# Altium schematic sheet psu.SchDoc
size A4
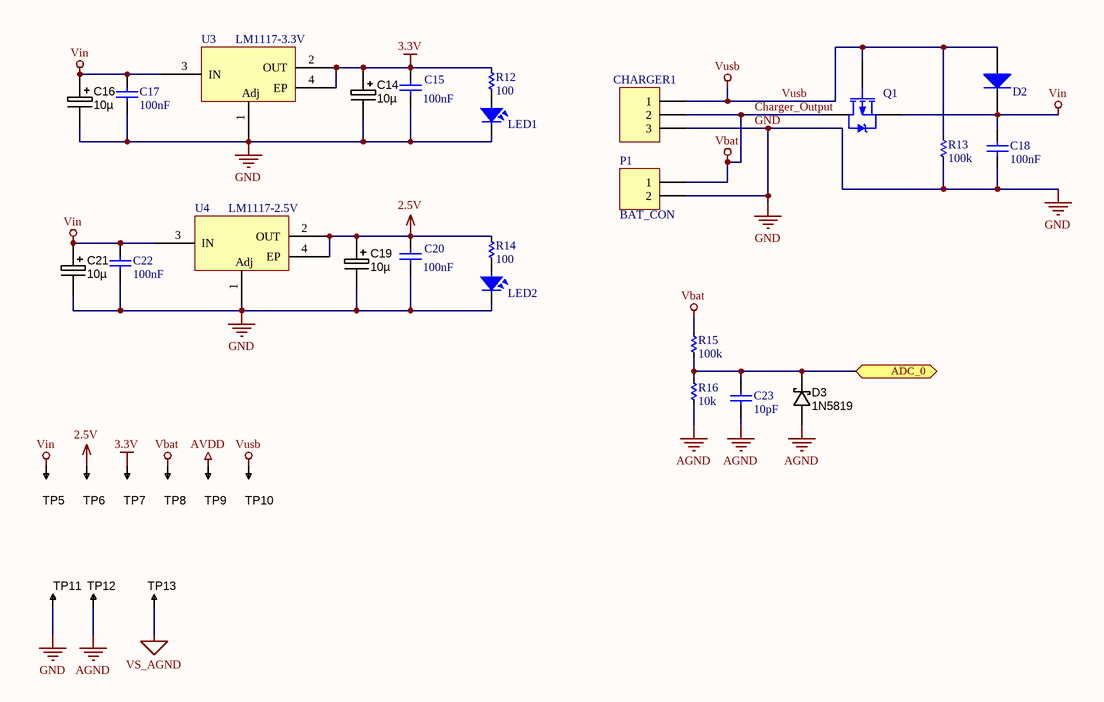
[diagram p0: psu.SchDoc]

## Parts
C14  10µ  [CAPMP3216X180N]
C15  value 100nF  [CAPC1608X90N]  (hidden comment: Cap Semi)
C16  10µ  [CAPMP3216X180N]
C17  value 100nF  [CAPC1608X90N]  (hidden comment: Cap Semi)
C18  value 100nF  [CAPC1608X90N]  (hidden comment: Cap Semi)
C19  10µ  [CAPMP3216X180N]
C20  value 100nF  [CAPC1608X90N]  (hidden comment: Cap Semi)
C21  10µ  [CAPMP3216X180N]
C22  value 100nF  [CAPC1608X90N]  (hidden comment: Cap Semi)
C23  value 10pF  [CAPC1608X90N]  (hidden comment: Cap Semi)
CHARGER1  3-Pin connector  [HDR1X3]  (value not drawn)
D2  Diode  [SMD Diode]  (value not drawn)
D3  Manufacturer Part Number 1: 1N5819  [SOD123]  (hidden comment: DIODE_SCHOTTKY_40V_1A)
LED1  LED  [LED-0805-Red]  (value not drawn)
LED2  LED  [LED-0805-Red]  (value not drawn)
P1  BAT_CON  [HDR1X2]
Q1  IRLML6402  [SOT-23B_N]  (value not drawn)
R12  value 100  [RES-SMD-0603]  (hidden comment: Res)
R13  value 100k  [RES-SMD-1206]  (hidden comment: Res)
R14  value 100  [RES-SMD-0603]  (hidden comment: Res)
R15  value 100k  [RES-SMD-0805]  (hidden comment: Res)
R16  value 10k  [RES-SMD-0805]  (hidden comment: Res)
TP5  TESTPOINT  [TP-R60]  (value not drawn)  (no BOM)
TP6  TESTPOINT  [TP-R60]  (value not drawn)  (no BOM)
TP7  TESTPOINT  [TP-R60]  (value not drawn)  (no BOM)
TP8  TESTPOINT  [TP-R60]  (value not drawn)  (no BOM)
TP9  TESTPOINT  [TP-R60]  (value not drawn)  (no BOM)
TP10  TESTPOINT  [TP-R60]  (value not drawn)  (no BOM)
TP11  TESTPOINT  [TP-R60]  (value not drawn)  (no BOM)
TP12  TESTPOINT  [TP-R60]  (value not drawn)  (no BOM)
TP13  TESTPOINT  [TP-R60]  (value not drawn)  (no BOM)
U3  LM1117-3.3V  [SOT230P700X180-4N]
U4  LM1117-2.5V  [SOT230P700X180-4N]

## Ports
ADC_0

## Nets
2.5V: C19.1 C20.2 R14.1 TP6.1 U4.2(OUT) U4.4(EP)
3.3V: C14.1 C15.2 R12.1 TP7.1 U3.2(OUT) U3.4(EP)
AGND: C23.1 D3.A R16.2 TP12.1
AVDD: TP9.1
Charger_Output: CHARGER1.2 P1.1 Q1.3(D) R15.1 TP8.1  [also labelled Vbat]
GND: C14.2 C15.1 C16.2 C17.1 C18.1 C19.2 C20.1 C21.2 C22.1 CHARGER1.3 LED1.2 LED2.2 P1.2 R13.2 TP11.1 U3.1(ADJ) U4.1(ADJ)
Vin: C16.1 C17.2 C18.2 C21.1 C22.2 D2.2(K) Q1.2(S) TP5.1 U3.3(IN) U4.3(IN)
VS_AGND: TP13.1
Vusb: CHARGER1.1 D2.1(A) Q1.1(G) R13.1 TP10.1
ADC_0: C23.2 D3.K R15.2 R16.1 ; port ADC_0
NetLED1_1: LED1.1 R12.2
NetLED2_1: LED2.1 R14.2

## Notes on the sheet
- (in symbol LM1117-4N) Adj

## Library data of the parts
C14 C16 C19 C21 = CAPT_68u_3216_6V3: Capacitor SMD Tantalum 68uF 10% 6.3V EIA 3216-18; Manufacturer 1: Kemet; Manufacturer Part Number 1: T491A686K006AT; Manufacturer Size Code: A; Material: Solid Tantalum; ESR (Equivalent Series Resistance): 4.000 Ohm; SCDType: spec; Package / Case: 1206 (3216 Metric); Ratings: 6.3V; Tolerance: ±10%; Supplier 1: Digi-Key; Supplier Part Number 1: 399-4698-1-ND; Operating Temperature: -55°C ~ 125°C; Size / Dimension: 0.126" L x 0.063" W (3.20mm x 1.60mm); Height - Seated (Max): 0.071" (1.80mm); ComponentLink1URL: http://www.kemet.com/datasheets&T491A686K006AT; ComponentLink1Description: http://www.kemet.com/datasheets&T491A686K006AT; Value: 10µ
C15 C17 C18 C20 C22 C23 = Cap Semi: Capacitor (Semiconductor SIM Model); Published: 8-Jun-2000; LatestRevisionDate: 29-May-2009; LatestRevisionNote: IPC-7351 Footprint Added.; PackageReference: C1206; Publisher: Altium Limited; PackageDescription: Chip Capacitor
CHARGER1 = Header 3: Revision: July-2002: Re-released for DXP Platform.
D2 = Diode: SS14, Schottky Diode; Published: 8-Jun-2000; LatestRevisionDate: 17-Jul-2002; LatestRevisionNote: Re-released for DXP Platform.; PackageVersion: Sep-1996; PackageReference: SMC; Publisher: Altium Limited; PackageDescription: DO-214-AB/SMC; 2 C-Bend Leads; Body 7.9 x 5.9 mm, inc. leads (LxW); Code_JEDEC: DO-214-AB
D3 = DIODE_SCHOTTKY_40V_1A: Diode Schottky SMD 40V 1A SOD123; Manufacturer 1: Diodes Inc; Ratings: 40V; 1A; Material: Si; SCDType: spec; Package / Case: SOD123; Diode Type: Schottky; Mounting Type: Surface Mount; Supplier 1: Digi-Key; Supplier Part Number 1: 1N5819HW-FDICT-ND
LED1 LED2 = LED SMD: Value: LED 3 - 5 ly 2 Colour
P1 = Header 2: Header, 2-Pin; LatestRevisionDate: 17-Jul-2002; LatestRevisionNote: Re-released for DXP Platform.; Publisher: Altium Limited
Q1 = IRLML6402: Note: Pin 2 is electrically connected to pin 4.; Published: 8-Jun-2000; LatestRevisionDate: 17-Jul-2002; LatestRevisionNote: Re-released for DXP Platform.; DatasheetVersion: Aug-1997; PackageVersion: Feb-1997; PackageReference: TO-220AB; Publisher: Altium Limited; PackageDescription: TO, Thru-Hole, Vertical, Heatsink Mounted; 3 In-Line Leads; Pitch 2.54 mm; ComponentLink1Description: Manufacturer Link; ComponentLink1URL: http://www.irf.com/; ComponentLink2Description: Datasheet; ComponentLink2URL: http://www.irf.com/product-info/datasheets/data/irf9z24n.pdf
R12-R16 = Res-SMD: Resistor; Manufacturer: Generic Components; Class: Passive; Published: 08/06/2000; Publisher: Altium Hobart Technology Centre
TP5-TP13 = TESTPOINT: SMD test pin
U3 U4 = LM1117-4N